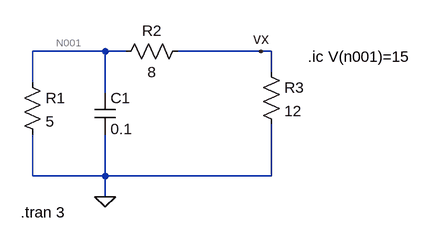
[diagram p0: schematic sadiku_chapter7_example_71.asc]
sadiku_chapter7_example_71.asc, the LTspice schematic file:
Version 4
SHEET 1 880 680
WIRE 144 96 32 96
WIRE 176 96 144 96
WIRE 384 96 256 96
WIRE 400 96 384 96
WIRE 400 128 400 96
WIRE 32 144 32 96
WIRE 144 160 144 96
WIRE 32 288 32 224
WIRE 144 288 144 224
WIRE 144 288 32 288
WIRE 400 288 400 208
WIRE 400 288 144 288
WIRE 144 320 144 288
FLAG 144 320 0
FLAG 384 96 vx
SYMBOL res 16 128 R0
SYMATTR InstName R1
SYMATTR Value 5
SYMBOL res 272 80 R90
WINDOW 0 0 56 VBottom 2
WINDOW 3 32 56 VTop 2
SYMATTR InstName R2
SYMATTR Value 8
SYMBOL res 384 112 R0
SYMATTR InstName R3
SYMATTR Value 12
SYMBOL cap 128 160 R0
SYMATTR InstName C1
SYMATTR Value 0.1
TEXT 456 104 Left 2 !.ic V(n001)=15
TEXT 14 344 Left 2 !.tran 3

The netlist it stands for:
* sadiku_chapter7_example_71.asc
R1 N001 0 5
R2 vx N001 8
R3 vx 0 12
C1 N001 0 0.1
.ic V(n001)=15
.tran 3
.backanno
.end

* Results of the author's LTspice run, read from the files saved beside the schematic
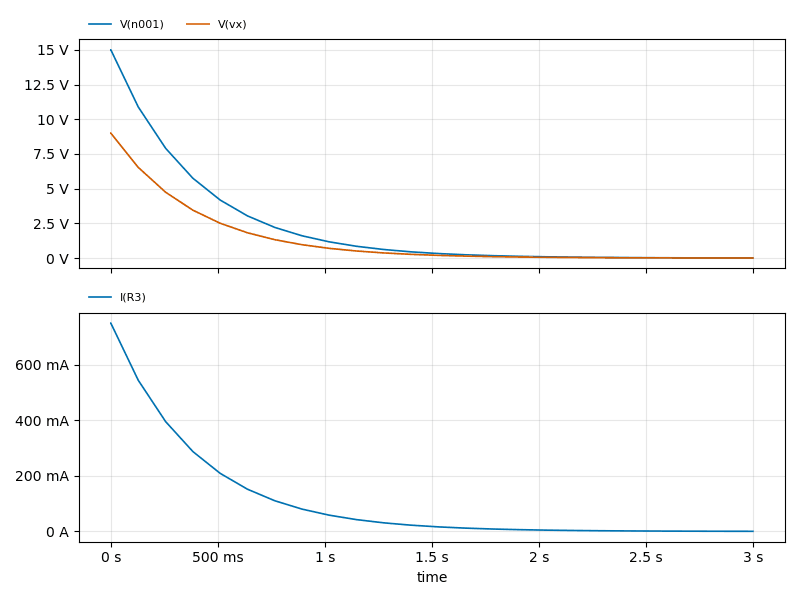
[diagram p1: Transient Analysis of sadiku_chapter7_example_71.asc, plotted from the saved traces]
* Transient Analysis, 1 run:
*   V(n001): min 8.296 mV, max 15 V, average 2.016 V, rms 3.938 V, last 8.296 mV
*   V(vx): min 4.978 mV, max 9 V, average 1.209 V, rms 2.363 V, last 4.978 mV
*   I(R3): min 414.8 µA, max 750 mA, average 100.8 mA, rms 196.9 mA, last 414.8 µA